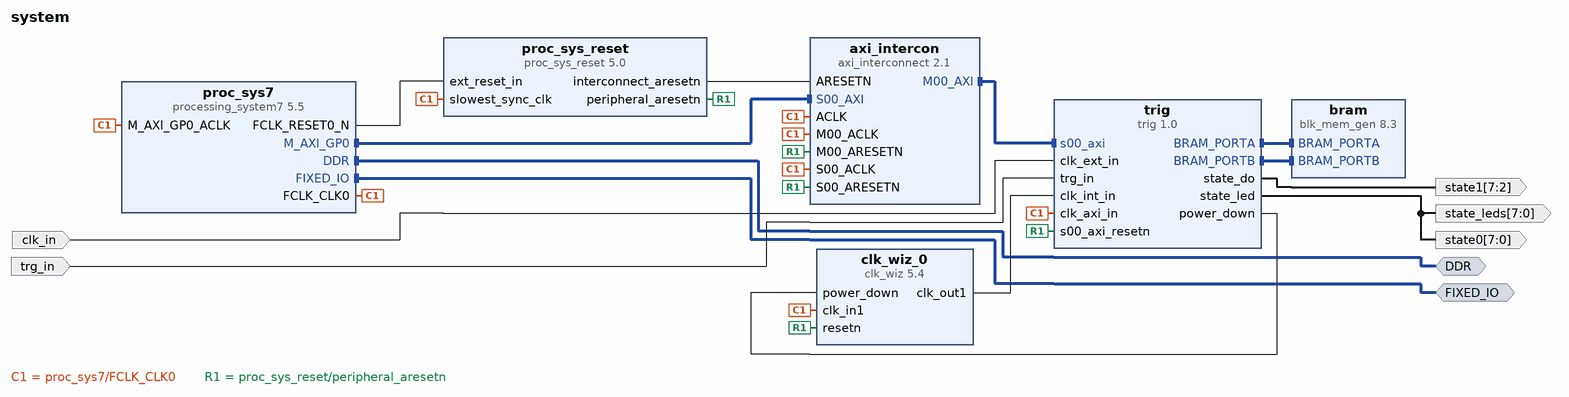
[diagram p0: block diagram of the top level]
# Vivado block design system, xc7z010clg400-1, Vivado 2017.2
create_bd_design system

create_bd_intf_port -mode Master -vlnv xilinx.com:interface:ddrx_rtl:1.0 DDR
create_bd_intf_port -mode Master -vlnv xilinx.com:display_processing_system7:fixedio_rtl:1.0 FIXED_IO
create_bd_port -dir I clk_in
create_bd_port -dir O -from 7 -to 2 state1
create_bd_port -dir O -from 7 -to 0 state0
create_bd_port -dir O -from 7 -to 0 state_leds
create_bd_port -dir I trg_in

create_bd_cell -type ip -vlnv xilinx.com:ip:blk_mem_gen:8.3 bram
set_property -dict [list \
  CONFIG.Memory_Type True_Dual_Port_RAM \
  CONFIG.Enable_32bit_Address false \
  CONFIG.Use_Byte_Write_Enable false \
  CONFIG.Write_Width_A 40 \
  CONFIG.Write_Depth_A 54272 \
  CONFIG.Read_Width_A 40 \
  CONFIG.Operating_Mode_A READ_FIRST \
  CONFIG.Enable_A Use_ENA_Pin \
  CONFIG.Write_Width_B 40 \
  CONFIG.Read_Width_B 40 \
  CONFIG.Operating_Mode_B READ_FIRST \
  CONFIG.Enable_B Always_Enabled \
  CONFIG.Register_PortA_Output_of_Memory_Primitives false \
  CONFIG.Register_PortB_Output_of_Memory_Primitives false \
  CONFIG.Fill_Remaining_Memory_Locations false \
  CONFIG.Use_RSTA_Pin false \
  CONFIG.Use_RSTB_Pin false \
  CONFIG.Port_B_Clock 100 \
  CONFIG.Port_B_Write_Rate 50 \
  CONFIG.Port_B_Enable_Rate 100 \
  CONFIG.use_bram_block Stand_Alone \
] [get_bd_cells bram]
create_bd_cell -type ip -vlnv xilinx.com:ip:processing_system7:5.5 proc_sys7
set_property -dict [list \
  CONFIG.PCW_UIPARAM_DDR_FREQ_MHZ 533.333333 \
  CONFIG.PCW_CRYSTAL_PERIPHERAL_FREQMHZ 33.333333333 \
  CONFIG.PCW_APU_PERIPHERAL_FREQMHZ 666.666666 \
  CONFIG.PCW_QSPI_PERIPHERAL_FREQMHZ 120 \
  CONFIG.PCW_SDIO_PERIPHERAL_FREQMHZ 100 \
  CONFIG.PCW_UART_PERIPHERAL_FREQMHZ 100 \
  CONFIG.PCW_I2C_PERIPHERAL_FREQMHZ 111.111115 \
  CONFIG.PCW_FPGA0_PERIPHERAL_FREQMHZ 125 \
  CONFIG.PCW_FPGA1_PERIPHERAL_FREQMHZ 20 \
  CONFIG.PCW_FPGA3_PERIPHERAL_FREQMHZ 10 \
  CONFIG.PCW_M_AXI_GP0_FREQMHZ 125 \
  CONFIG.PCW_PERIPHERAL_BOARD_PRESET None \
  CONFIG.PCW_PRESET_BANK1_VOLTAGE {LVCMOS 2.5V} \
  CONFIG.PCW_UIPARAM_DDR_BUS_WIDTH {16 Bit} \
  CONFIG.PCW_UIPARAM_DDR_PARTNO {MT41J256M16 RE-125} \
  CONFIG.PCW_QSPI_PERIPHERAL_ENABLE 1 \
  CONFIG.PCW_QSPI_QSPI_IO {MIO 1 .. 6} \
  CONFIG.PCW_QSPI_GRP_SINGLE_SS_ENABLE 1 \
  CONFIG.PCW_QSPI_GRP_SINGLE_SS_IO {MIO 1 .. 6} \
  CONFIG.PCW_ENET0_PERIPHERAL_ENABLE 1 \
  CONFIG.PCW_ENET0_ENET0_IO {MIO 16 .. 27} \
  CONFIG.PCW_ENET0_GRP_MDIO_ENABLE 1 \
  CONFIG.PCW_ENET0_GRP_MDIO_IO {MIO 52 .. 53} \
  CONFIG.PCW_ENET_RESET_ENABLE 1 \
  CONFIG.PCW_ENET_RESET_SELECT {Share reset pin} \
  CONFIG.PCW_ENET0_RESET_ENABLE 0 \
  CONFIG.PCW_SD0_PERIPHERAL_ENABLE 1 \
  CONFIG.PCW_SD0_SD0_IO {MIO 40 .. 45} \
  CONFIG.PCW_SD0_GRP_CD_ENABLE 1 \
  CONFIG.PCW_SD0_GRP_CD_IO {MIO 46} \
  CONFIG.PCW_SD0_GRP_WP_ENABLE 1 \
  CONFIG.PCW_SD0_GRP_WP_IO {MIO 47} \
  CONFIG.PCW_UART0_PERIPHERAL_ENABLE 1 \
  CONFIG.PCW_UART0_UART0_IO {MIO 14 .. 15} \
  CONFIG.PCW_UART1_PERIPHERAL_ENABLE 1 \
  CONFIG.PCW_UART1_UART1_IO {MIO 8 .. 9} \
  CONFIG.PCW_SPI0_PERIPHERAL_ENABLE 1 \
  CONFIG.PCW_SPI0_SPI0_IO EMIO \
  CONFIG.PCW_SPI1_PERIPHERAL_ENABLE 1 \
  CONFIG.PCW_SPI1_SPI1_IO {MIO 10 .. 15} \
  CONFIG.PCW_CAN0_PERIPHERAL_ENABLE 1 \
  CONFIG.PCW_CAN0_CAN0_IO EMIO \
  CONFIG.PCW_TTC0_PERIPHERAL_ENABLE 1 \
  CONFIG.PCW_TTC0_TTC0_IO EMIO \
  CONFIG.PCW_USB0_PERIPHERAL_ENABLE 1 \
  CONFIG.PCW_USB0_USB0_IO {MIO 28 .. 39} \
  CONFIG.PCW_USB_RESET_ENABLE 1 \
  CONFIG.PCW_USB_RESET_SELECT {Share reset pin} \
  CONFIG.PCW_I2C0_PERIPHERAL_ENABLE 1 \
  CONFIG.PCW_I2C0_I2C0_IO {MIO 50 .. 51} \
  CONFIG.PCW_I2C0_GRP_INT_ENABLE 0 \
  CONFIG.PCW_I2C_RESET_ENABLE 1 \
  CONFIG.PCW_I2C_RESET_SELECT {Share reset pin} \
  CONFIG.PCW_GPIO_MIO_GPIO_ENABLE 1 \
  CONFIG.PCW_GPIO_MIO_GPIO_IO MIO \
  CONFIG.PCW_GPIO_EMIO_GPIO_ENABLE 1 \
  CONFIG.PCW_GPIO_EMIO_GPIO_IO 64 \
  CONFIG.PCW_UIPARAM_GENERATE_SUMMARY NONE \
] [get_bd_cells proc_sys7]
# 489 more settings of proc_sys7 are not shown: defaults, MIO pin electricals, DDR timing, and values the tool derives
create_bd_cell -type ip -vlnv xilinx.com:ip:proc_sys_reset:5.0 proc_sys_reset
create_bd_cell -type ip -vlnv xilinx.com:ip:axi_interconnect:2.1 axi_intercon
set_property -dict {CONFIG.NUM_MI 1 CONFIG.S00_HAS_REGSLICE 3 CONFIG.S00_HAS_DATA_FIFO 1} [get_bd_cells axi_intercon]
create_bd_cell -type ip -vlnv rp:ip:trig:1.0 trig
set_property -dict {CONFIG.ADDR_WIDTH 16 CONFIG.INT_CLK_EXP 1} [get_bd_cells trig]
create_bd_cell -type ip -vlnv xilinx.com:ip:clk_wiz:5.4 clk_wiz_0
set_property -dict [list \
  CONFIG.PRIMITIVE PLL \
  CONFIG.USE_MIN_POWER true \
  CONFIG.JITTER_SEL No_Jitter \
  CONFIG.CLKIN1_JITTER_PS 80.0 \
  CONFIG.CLKOUT1_REQUESTED_OUT_FREQ 20.000 \
  CONFIG.PRIM_SOURCE Global_buffer \
  CONFIG.CLKOUT1_DRIVES BUFGCE \
  CONFIG.CLKOUT2_DRIVES BUFGCE \
  CONFIG.CLKOUT3_DRIVES BUFGCE \
  CONFIG.CLKOUT4_DRIVES BUFGCE \
  CONFIG.CLKOUT5_DRIVES BUFGCE \
  CONFIG.CLKOUT6_DRIVES BUFGCE \
  CONFIG.CLKOUT7_DRIVES BUFGCE \
  CONFIG.FEEDBACK_SOURCE FDBK_AUTO \
  CONFIG.USE_LOCKED true \
  CONFIG.USE_POWER_DOWN true \
  CONFIG.RESET_PORT resetn \
  CONFIG.MMCM_DIVCLK_DIVIDE 5 \
  CONFIG.MMCM_BANDWIDTH OPTIMIZED \
  CONFIG.MMCM_CLKFBOUT_MULT_F 36 \
  CONFIG.MMCM_CLKIN1_PERIOD 8.000 \
  CONFIG.MMCM_CLKIN2_PERIOD 10.0 \
  CONFIG.MMCM_COMPENSATION ZHOLD \
  CONFIG.MMCM_CLKOUT0_DIVIDE_F 45 \
  CONFIG.MMCM_CLKOUT0_DUTY_CYCLE 0.5 \
  CONFIG.RESET_TYPE ACTIVE_LOW \
  CONFIG.USE_SAFE_CLOCK_STARTUP true \
  CONFIG.CLKOUT1_JITTER 330.728 \
  CONFIG.CLKOUT1_PHASE_ERROR 249.865 \
] [get_bd_cells clk_wiz_0]

# ---- connections ----

connect_bd_intf_net -intf_net rp_trig_0_BRAM_PORTA [get_bd_intf_pins bram/BRAM_PORTA] [get_bd_intf_pins trig/BRAM_PORTA]
connect_bd_intf_net -intf_net rp_trig_0_BRAM_PORTB [get_bd_intf_pins bram/BRAM_PORTB] [get_bd_intf_pins trig/BRAM_PORTB]
connect_bd_intf_net [get_bd_intf_pins proc_sys7/M_AXI_GP0] [get_bd_intf_pins axi_intercon/S00_AXI]
connect_bd_intf_net [get_bd_intf_pins axi_intercon/M00_AXI] [get_bd_intf_pins trig/s00_axi]
connect_bd_intf_net [get_bd_intf_ports DDR] [get_bd_intf_pins proc_sys7/DDR]
connect_bd_intf_net [get_bd_intf_ports FIXED_IO] [get_bd_intf_pins proc_sys7/FIXED_IO]
connect_bd_net [get_bd_pins proc_sys7/FCLK_CLK0] \
  [get_bd_pins proc_sys7/M_AXI_GP0_ACLK] [get_bd_pins proc_sys_reset/slowest_sync_clk] [get_bd_pins trig/clk_axi_in] \
  [get_bd_pins clk_wiz_0/clk_in1] [get_bd_pins axi_intercon/ACLK] [get_bd_pins axi_intercon/S00_ACLK] \
  [get_bd_pins axi_intercon/M00_ACLK]
connect_bd_net [get_bd_pins proc_sys_reset/peripheral_aresetn] \
  [get_bd_pins trig/s00_axi_resetn] [get_bd_pins clk_wiz_0/resetn] [get_bd_pins axi_intercon/S00_ARESETN] \
  [get_bd_pins axi_intercon/M00_ARESETN]
connect_bd_net [get_bd_pins proc_sys7/FCLK_RESET0_N] [get_bd_pins proc_sys_reset/ext_reset_in]
connect_bd_net -net clk_1 [get_bd_ports clk_in] [get_bd_pins trig/clk_ext_in]
connect_bd_net -net rp_trig_0_state_do [get_bd_pins trig/state_do] [get_bd_ports state1]
connect_bd_net -net rp_trig_0_state_led [get_bd_pins trig/state_led] [get_bd_ports state_leds] [get_bd_ports state0]
connect_bd_net [get_bd_ports trg_in] [get_bd_pins trig/trg_in]
connect_bd_net [get_bd_pins proc_sys_reset/interconnect_aresetn] [get_bd_pins axi_intercon/ARESETN]
connect_bd_net [get_bd_pins clk_wiz_0/clk_out1] [get_bd_pins trig/clk_int_in]
connect_bd_net [get_bd_pins trig/power_down] [get_bd_pins clk_wiz_0/power_down]

# ---- address map ----
assign_bd_address -offset 0x44000000 -range 4M -target_address_space [get_bd_addr_spaces proc_sys7/Data] [get_bd_addr_segs trig/s00_axi/reg0]

validate_bd_design
save_bd_design
